# EAGLE schematic LDR Schematic (EAGLE 9.7.0)
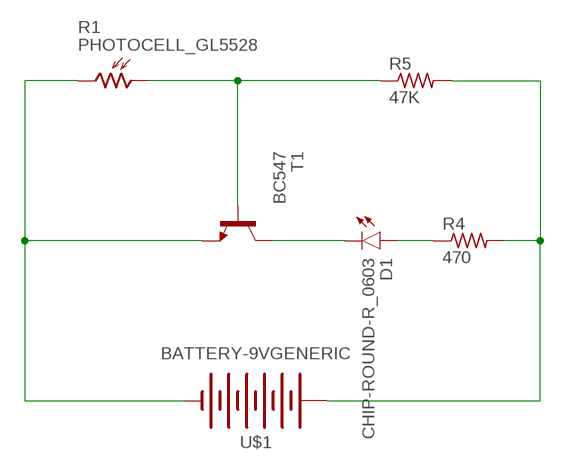
[diagram p0: schematic, sheet 1]

## Parts
D1  CHIP-ROUND-R_0603  [LEDC1608X65N_RND-R]
R1  PHOTOCELL_GL5528  [GL5528]
R4  470  R-US_R0402  [R0402]
R5  47K  R-US_R0402  [R0402]
T1  BC547  [TO92]
U$1  BATTERY-9VGENERIC  [BATTERY-GENERIC]

## Nets
N$1: R1.2 T1.1(E) U$1.-
N$3: R1.1 R5.1 T1.2(B)
N$4: D1.C T1.3(C)
N$5: D1.A R4.1
N$6: R4.2 R5.2 U$1.+

## Library data of the parts
D1 = LED:CHIP-ROUND-R: Red LED - Generic; CATEGORY: LED; COLOR: Red; DESCRIPTION: Red LED Indication 0603 (1608 Metric); PACKAGE_SIZE: 0603; PACKAGE_TYPE: SMD; SUBCATEGORY: Chip LED; TYPE: Square with Domed Top
R1 = Tinkercad:PHOTOCELL: Photoresistor / Photoconductive cells Reference Datasheet <https://www.sunrom.com/get/753444>
R4 R5 = rcl:R-US_: RESISTOR, American symbol; SPICEPREFIX: R
T1 = transistor:BC547: NPN TRANSISTOR
U$1 = Tinkercad:BATTERY-9V